# EasyEDA schematic 3Dprinter-laser-master.json
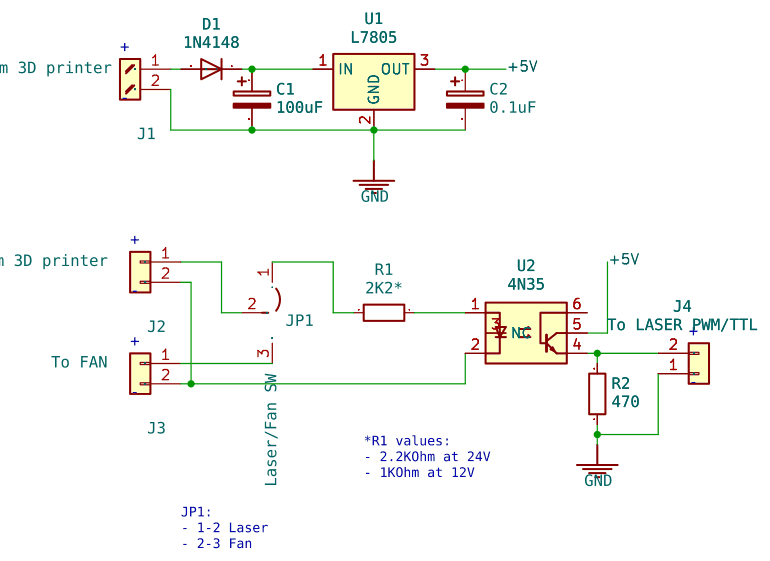
[diagram p0: schematic sheet]

## Parts
C1  100uF  [CP_RADIAL_D8.0MM_P3.50MM]
C2  0.1uF  [CP_RADIAL_D5.0MM_P2.00MM]
D1  1N4148  [D_DO-34_SOD68_P7.62MM_HORIZONTAL]
J1  12/24V from 3D printer  [PHOENIXCONTACT_MSTBA_2,5_2-G_1X02_P5.00MM_HORIZONTAL]
J2  FAN from 3D printer  [JST_XH_B02B-XH-A_1X02_P2.50MM_VERTICAL]
J3  To FAN  [JST_XH_B02B-XH-A_1X02_P2.50MM_VERTICAL]
J4  To LASER PWM/TTL  [JST_XH_B02B-XH-A_1X02_P2.50MM_VERTICAL]
JP1  Laser/Fan SW  [PINHEADER_1X03_P2.54MM_VERTICAL]
R1  2K2*  [R_AXIAL_DIN0207_L6.3MM_D2.5MM_P7.62MM_HORIZONTAL]
R2  470  [R_AXIAL_DIN0207_L6.3MM_D2.5MM_P7.62MM_HORIZONTAL]
U1  L7805  [TO-92_INLINE]
U2  4N35  [DIP-6_W7.62MM]

## Library data of the parts
U1 = -: Datasheet: http://www.st.com/content/ccc/resource/technical/document/datasheet/41/4f/b3/b0/12/d4/47/88/CD00000444.pdf/files/CD00000444.pdf/jcr:content/translations/en.CD00000444.pdf
U2 = -: Datasheet: https://www.vishay.com/docs/81181/4n35.pdf

## Nets
+5V: C2.1 U1.3(OUT) U2.5
GND: C1.2 C2.2 J1.2(Pin) J4.1(Pin) R2.1 U1.2(GND)
Net-(C1-1): C1.1 D1.1(K) U1.1(IN)
Net-(D1-2): D1.2(A) J1.1(Pin)
Net-(J2-1): J2.1(Pin) JP1.2(C)
Net-(J2-2): J2.2(Pin) J3.2(Pin) U2.2
Net-(J3-1): J3.1(Pin) JP1.3(B)
Net-(J4-2): J4.2(Pin) R2.2 U2.4
Net-(JP1-1): JP1.1(A) R1.2
Net-(R1-1): R1.1 U2.1

Not connected (* = marked no-connect by the designer): U2 3(NC) 6

## Notes on the sheet
- +
- -
- +
- -
- +
- +
- -
- -
- *R1 values:
  - 2.2KOhm at 24V
  - 1KOhm at 12V
- JP1:
  - 1-2 Laser
  - 2-3 Fan
